# Altium schematic sheet Power.SchDoc
size A4
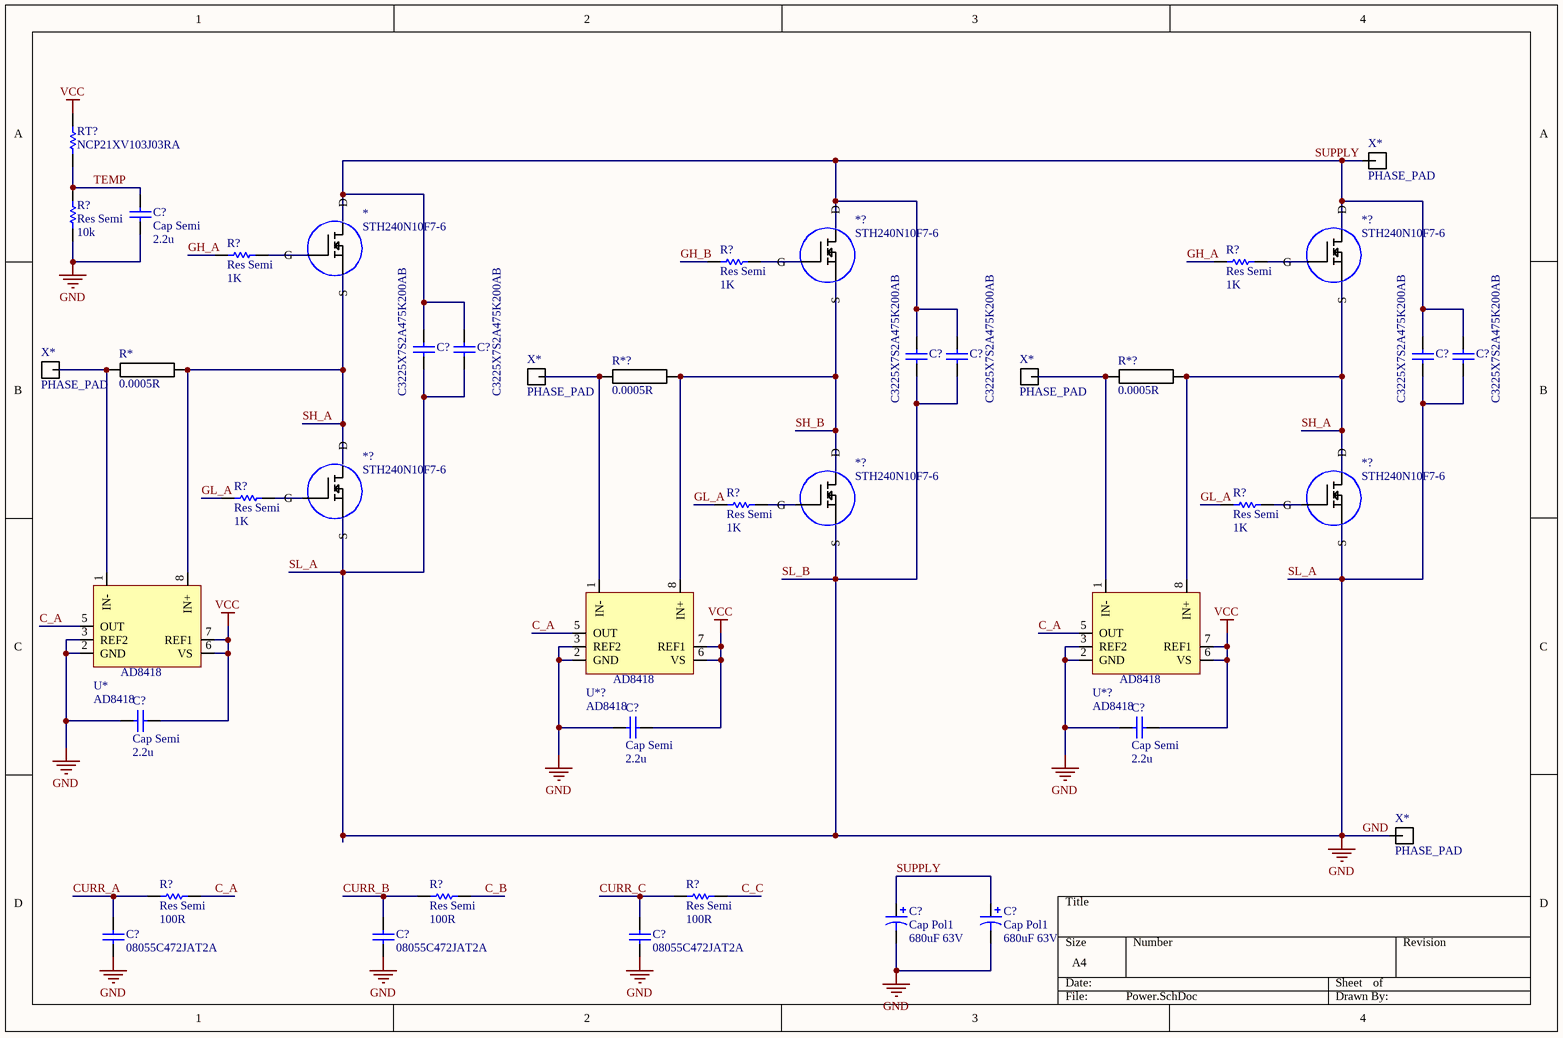
[diagram p0: Power.SchDoc]

## Parts
(Parts that share a designator on the sheet are numbered #1, #2 ... from top to bottom, then left to right.)
*  STH240N10F7-6  [*TO-263-7]
*?#1  STH240N10F7-6  [*TO-263-7]
*?#2  STH240N10F7-6  [*TO-263-7]
*?#3  STH240N10F7-6  [*TO-263-7]
*?#4  STH240N10F7-6  [*TO-263-7]
*?#5  STH240N10F7-6  [*TO-263-7]
C?#1  Cap Semi  value 2.2u  [C1206]
C?#2  C3225X7S2A475K200AB  [CAPC3225X220X20ML40]
C?#3  C3225X7S2A475K200AB  [CAPC3225X220X20ML40]
C?#4  C3225X7S2A475K200AB  [CAPC3225X220X20ML40]
C?#5  C3225X7S2A475K200AB  [CAPC3225X220X20ML40]
C?#6  C3225X7S2A475K200AB  [CAPC3225X220X20ML40]
C?#7  C3225X7S2A475K200AB  [CAPC3225X220X20ML40]
C?#8  Cap Semi  value 2.2u  [C1206]
C?#9  Cap Semi  value 2.2u  [C1206]
C?#10  Cap Semi  value 2.2u  [C1206]
C?#11  Cap Pol1  value 680uF 63V  [RB7.6-15]
C?#12  Cap Pol1  value 680uF 63V  [RB7.6-15]
C?#13  08055C472JAT2A  [CAPC2013X94X50NL20T25]
C?#14  08055C472JAT2A  [CAPC2013X94X50NL20T25]
C?#15  08055C472JAT2A  [CAPC2013X94X50NL20T25]
R*  0.0005R  [*RESC5125X80N]
R*?#1  0.0005R  [*RESC5125X80N]
R*?#2  0.0005R  [*RESC5125X80N]
R?#1  Res Semi  value 10k  [AXIAL-0.5]
R?#2  Res Semi  value 1K  [AXIAL-0.5]
R?#3  Res Semi  value 1K  [AXIAL-0.5]
R?#4  Res Semi  value 1K  [AXIAL-0.5]
R?#5  Res Semi  value 1K  [AXIAL-0.5]
R?#6  Res Semi  value 1K  [AXIAL-0.5]
R?#7  Res Semi  value 1K  [AXIAL-0.5]
R?#8  Res Semi  value 100R  [AXIAL-0.5]
R?#9  Res Semi  value 100R  [AXIAL-0.5]
R?#10  Res Semi  value 100R  [AXIAL-0.5]
RT?  NCP21XV103J03RA  [RESC2013X100X45LL20T25]
U*  AD8418  [*SOP65P490X110-8N]
U*?#1  AD8418  [*SOP65P490X110-8N]
U*?#2  AD8418  [*SOP65P490X110-8N]
X*#1  PHASE_PAD  [PHASE_PAD]
X*#2  PHASE_PAD  [PHASE_PAD]
X*#3  PHASE_PAD  [PHASE_PAD]
X*#4  PHASE_PAD  [PHASE_PAD]
X*#5  PHASE_PAD  [PHASE_PAD]

## Nets
GND: *?#3.S *?#4.S *?#5.S C?#1.1 C?#2.1 C?#3.1 C?#4.1 C?#5.1 C?#6.1 C?#7.1 C?#8.1 C?#9.1 C?#10.1 C?#11.2 C?#12.2 C?#13.1 C?#14.1 C?#15.1 R?#1.1 U*.2(GND) U*.3(REF2) U*?#1.2(GND) U*?#1.3(REF2) U*?#2.2(GND) U*?#2.3(REF2)  [also labelled SL_A, SL_B]
VCC: C?#8.2 C?#9.2 C?#10.2 RT?.2 U*.6(VS) U*.7(REF1) U*?#1.6(VS) U*?#1.7(REF1) U*?#2.6(VS) U*?#2.7(REF1)
C_A: R?#8.2 U*.5(OUT) U*?#1.5(OUT) U*?#2.5(OUT)
C_B: R?#9.2
C_C: R?#10.2
CURR_A: C?#13.2 R?#8.1
CURR_B: C?#14.2 R?#9.1
CURR_C: C?#15.2 R?#10.1
GH_A: R?#2.1 R?#4.1
GH_B: R?#3.1
GL_A: R?#5.1 R?#6.1 R?#7.1
SH_A: *.S *?#2.S *?#3.D *?#5.D R*.1 R*?#2.1 U*.8(IN+) U*?#2.8(IN+)
SH_B: *?#1.S *?#4.D R*?#1.1 U*?#1.8(IN+)
SUPPLY: *.D *?#1.D *?#2.D C?#2.2 C?#3.2 C?#4.2 C?#5.2 C?#6.2 C?#7.2 C?#11.1 C?#12.1
TEMP: C?#1.2 R?#1.2 RT?.1
Net*?#1_G: *?#1.G R?#3.2
Net*?#2_G: *?#2.G R?#4.2
Net*_G: *.G R?#2.2
NetR*?#1_2: R*?#1.2 U*?#1.1(IN-) X*#3.1
NetR*?#2_2: R*?#2.2 U*?#2.1(IN-) X*#4.1
NetR*_2: R*.2 U*.1(IN-) X*#2.1

Not connected (* = marked no-connect by the designer): *?#3 G; *?#4 G; *?#5 G; R?#5 2; R?#6 2; R?#7 2; X*#1 1; X*#5 1

## Library data of the parts
C?#1 C?#8-C?#10 = Cap Semi: Capacitor (Semiconductor SIM Model); Published: 8-Jun-2000; LatestRevisionDate: 29-May-2009; LatestRevisionNote: IPC-7351 Footprint Added.; PackageReference: C1206; Publisher: Altium Limited; PackageDescription: Chip Capacitor
C?#2-C?#7 = CMP-2000-05456-1: Chip Capacitor, 4.7 uF, +/- 10%, 100 V, -55 to 125 degC, 1210 (3225 Metric), RoHS, Tape and Reel; PCN Part Number: MLCCPartNumberChange30/Nov/2012; Manufacturer: TDK; Featured Product: MidVoltageX7S-100VMLCCsC-SeriesMidVoltageMLCCs; Capacitance: 4.7µF; Catalog Drawings: CSERIES_1210_2.2; Product Training Modules: SEAT,CCV,andTVCLDesignToolsCSeriesMidVoltageCapacitorsFamilyGuidetoReplacinganElectrolyticCapacitorwithanMLCC; Voltage - Rated: 100V; Temperature Coefficient: X7S; Other Names: 445-6042-1; Online Catalog: CSeries,MidVoltage; Kits: 445-9009-KIT-ND-KITCAPCERHICAP100V-630VSMD; Mounting Type: SurfaceMount,MLCC; Ratings: -; Lead Spacing: -; Package Reference: 3225; Thickness (Max): 0.087"(2.20mm); Features: -; Category: Capacitors; Size / Dimension: 0.126"Lx0.098"W(3.20mmx2.50mm); Tolerance: ±10%; Series: C; Datasheet URL: http://download.siliconexpert.com/pdfs/2013/1/31/7/41/13/446/tdk_/manual/c3225x7s2a475k200ab.pdf; Lead Style: -; Manufacturer URL: http://www.tdk.com/; RoHS Information: RoHSCertificate-MLCC; Datasheet Version: Jan-13; Package / Case: 1210(3225Metric); Package Description: 2-Pin Surface Mount Device, Body 3.2 x 2.5 mm; Standard Package: 1; Applications: GeneralPurpose; Packaging: CutTape(CT); Family: CeramicCapacitors; Height - Seated (Max): -; Operating Temperature: -55degC~125degC
C?#11 C?#12 = Cap Pol1: Polarized Capacitor (Radial); Published: 8-Jun-2000; LatestRevisionDate: 17-Jul-2002; LatestRevisionNote: Re-released for DXP Platform.; PackageReference: RB7.6-15; Publisher: Altium Limited; PackageDescription: Polarized Capacitor (Radial); 2 Leads
C?#13-C?#15 = CMP-2007-04421-1: Manufacturer: AVX Interconnect / Elco; Part Number: 08055C472JAT2A
R?#1-R?#10 = Res Semi: Semiconductor Resistor; Published: 8-Jun-2000; LatestRevisionDate: 17-Jul-2002; LatestRevisionNote: Re-released for DXP Platform.; PackageReference: AXIAL-0.5; Publisher: Altium Limited; PackageDescription: Axial Device, Thru-Hole; 2 Leads; 0.5 in Pin Spacing
RT? = CMP-2000-06827-1: Chip Thermistor, 10 KOhm, +/- 5%, 200 mW, -40 to 125 degC, 0805 (2012 Metric), RoHS, Tape and Reel; Manufacturer: Murata; Rated Current: 0.44mA; B-constant: 3934K; Resistance: 10kO; Datasheet URL: http://www.murata.com/~/media/webrenewal/support/library/catalog/products/thermistor/ntc/r44e.ashx; Tolerance (%): ±5%; Package Description: 2-Pin Surface Mount Device, Body 2 x 1.25 mm; Temperature Range: -40to+125°C; Manufacturer URL: http://www.murata.com/; Mounting Technology: SurfaceMount; Type: NTC; Package Reference: 0805; Datasheet Version: 12/2014